# Altium schematic sheet DRV2605L.SchDoc
size A4
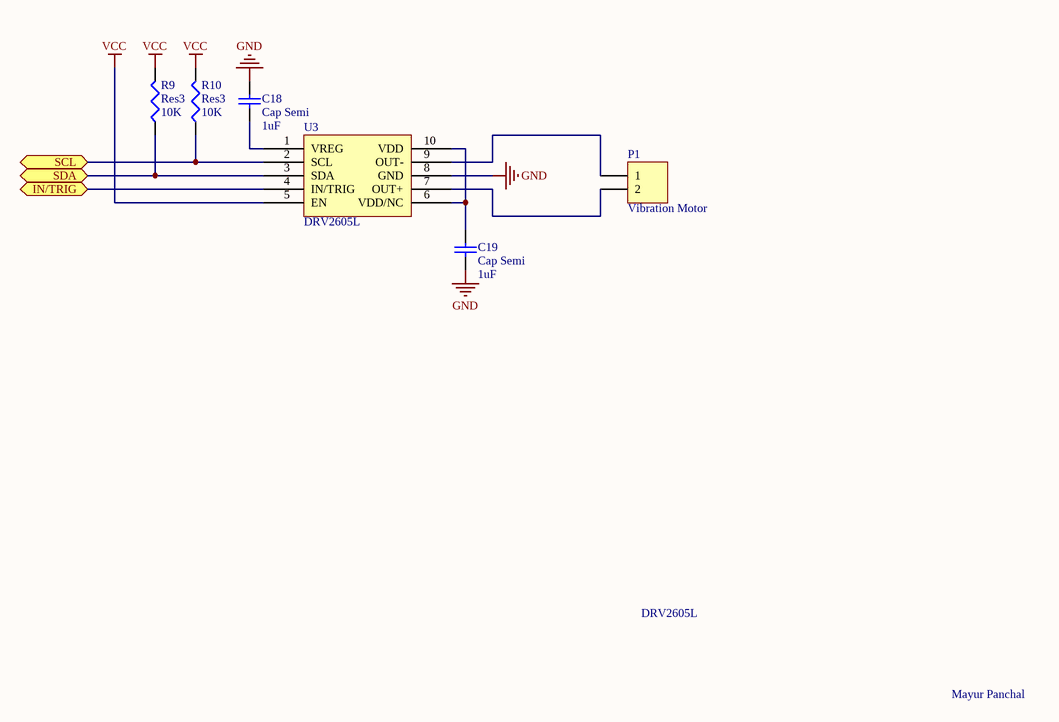
[diagram p0: DRV2605L.SchDoc]

## Parts
C18  Cap Semi  value 1uF  [1608[0603]]
C19  Cap Semi  value 1uF  [1608[0603]]
P1  Vibration Motor  [HDR1X2]
R9  Res3  value 10K  [J1-0603]
R10  Res3  value 10K  [J1-0603]
U3  DRV2605L  [DRV2605L]

## Ports
IN/TRIG, SCL, SDA

## Nets
GND: C18.2 C19.1 U3.8(GND)
VCC: R9.2 R10.2 U3.5(EN)
IN/TRIG: U3.4(IN/TRIG) ; port IN/TRIG
SCL: R10.1 U3.2(SCL) ; port SCL
SDA: R9.1 U3.3(SDA) ; port SDA
NetC18_1: C18.1 U3.1(VREG)
NetC19_2: C19.2 U3.6(VDD/NC) U3.10(VDD)
NetP1_1: P1.1 U3.9(OUT-)
NetP1_2: P1.2 U3.7(OUT+)

## Notes on the sheet
- DRV2605L
- Mayur Panchal

## Library data of the parts
C18 C19 = Cap Semi: Capacitor (Semiconductor SIM Model); Published: 8-Jun-2000; LatestRevisionDate: 29-May-2009; LatestRevisionNote: IPC-7351 Footprint Added.; PackageReference: C1206; Publisher: Altium Limited; PackageDescription: Chip Capacitor
P1 = Header 2: Header, 2-Pin; LatestRevisionDate: 17-Jul-2002; LatestRevisionNote: Re-released for DXP Platform.; Publisher: Altium Limited
R9 R10 = Res3: Resistor; Published: 8-Jun-2000; LatestRevisionDate: 29-May-2009; LatestRevisionNote: IPC-7351 Footprint Added.; PackageReference: J1-0603; Publisher: Altium Limited; PackageDescription: Chip Resistor